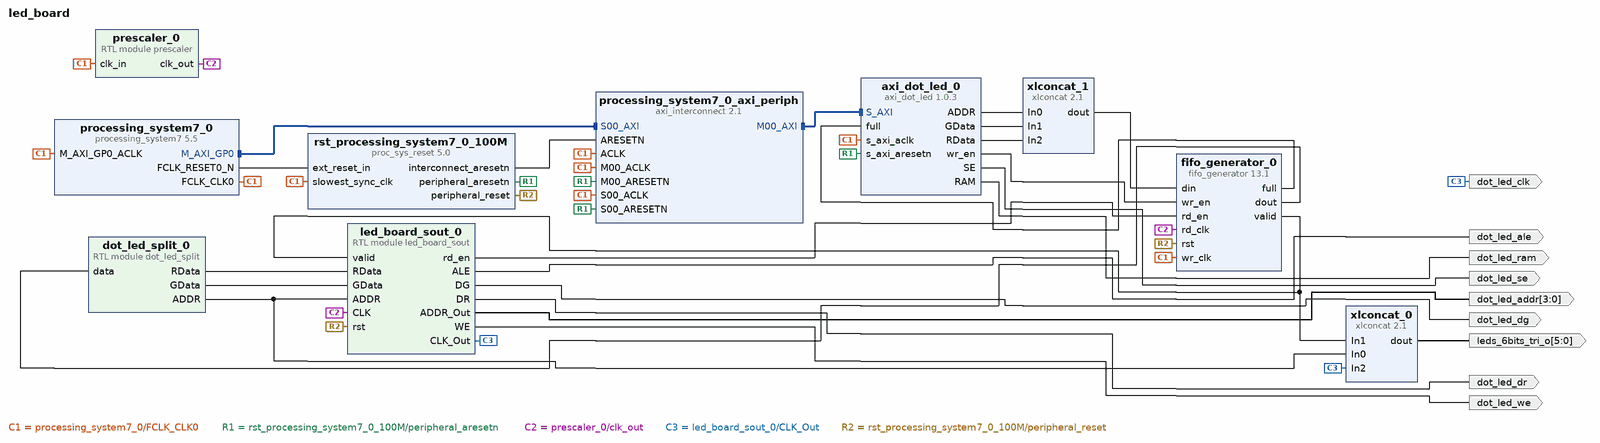
[diagram p0: block diagram of the top level]
# Vivado block design led_board, Vivado 2016.1
create_bd_design led_board

create_bd_port -dir O dot_led_se
create_bd_port -dir O dot_led_ram
create_bd_port -dir O dot_led_ale
create_bd_port -dir O dot_led_dr
create_bd_port -dir O dot_led_dg
create_bd_port -dir O dot_led_we
create_bd_port -dir O dot_led_clk
create_bd_port -dir O -from 5 -to 0 leds_6bits_tri_o
create_bd_port -dir O -from 3 -to 0 dot_led_addr

create_bd_cell -type ip -vlnv xilinx.com:ip:processing_system7:5.5 processing_system7_0
set_property -dict [list \
  CONFIG.PCW_FCLK_CLK0_BUF true \
  CONFIG.PCW_UIPARAM_DDR_FREQ_MHZ 525 \
  CONFIG.PCW_CRYSTAL_PERIPHERAL_FREQMHZ 50 \
  CONFIG.PCW_APU_PERIPHERAL_FREQMHZ 650 \
  CONFIG.PCW_SDIO_PERIPHERAL_FREQMHZ 50 \
  CONFIG.PCW_UART_PERIPHERAL_FREQMHZ 100 \
  CONFIG.PCW_FPGA0_PERIPHERAL_FREQMHZ 100 \
  CONFIG.PCW_FPGA1_PERIPHERAL_FREQMHZ 50 \
  CONFIG.PCW_M_AXI_GP0_FREQMHZ 10 \
  CONFIG.PCW_PERIPHERAL_BOARD_PRESET None \
  CONFIG.PCW_PRESET_BANK1_VOLTAGE {LVCMOS 1.8V} \
  CONFIG.PCW_UIPARAM_DDR_BUS_WIDTH {16 Bit} \
  CONFIG.PCW_UIPARAM_DDR_PARTNO {MT41J256M16 RE-125} \
  CONFIG.PCW_QSPI_PERIPHERAL_ENABLE 1 \
  CONFIG.PCW_QSPI_QSPI_IO {MIO 1 .. 6} \
  CONFIG.PCW_QSPI_GRP_SINGLE_SS_ENABLE 1 \
  CONFIG.PCW_QSPI_GRP_SINGLE_SS_IO {MIO 1 .. 6} \
  CONFIG.PCW_QSPI_GRP_FBCLK_ENABLE 1 \
  CONFIG.PCW_QSPI_GRP_FBCLK_IO {MIO 8} \
  CONFIG.PCW_ENET0_PERIPHERAL_ENABLE 1 \
  CONFIG.PCW_ENET0_ENET0_IO {MIO 16 .. 27} \
  CONFIG.PCW_ENET0_GRP_MDIO_ENABLE 1 \
  CONFIG.PCW_ENET0_GRP_MDIO_IO {MIO 52 .. 53} \
  CONFIG.PCW_ENET_RESET_ENABLE 1 \
  CONFIG.PCW_ENET_RESET_SELECT {Share reset pin} \
  CONFIG.PCW_ENET0_RESET_ENABLE 1 \
  CONFIG.PCW_ENET0_RESET_IO {MIO 9} \
  CONFIG.PCW_SD0_PERIPHERAL_ENABLE 1 \
  CONFIG.PCW_SD0_SD0_IO {MIO 40 .. 45} \
  CONFIG.PCW_SD0_GRP_CD_ENABLE 1 \
  CONFIG.PCW_SD0_GRP_CD_IO {MIO 47} \
  CONFIG.PCW_SD0_GRP_WP_ENABLE 0 \
  CONFIG.PCW_UART0_PERIPHERAL_ENABLE 1 \
  CONFIG.PCW_UART0_UART0_IO {MIO 14 .. 15} \
  CONFIG.PCW_UART1_PERIPHERAL_ENABLE 0 \
  CONFIG.PCW_USB0_PERIPHERAL_ENABLE 1 \
  CONFIG.PCW_USB0_USB0_IO {MIO 28 .. 39} \
  CONFIG.PCW_USB_RESET_ENABLE 1 \
  CONFIG.PCW_USB_RESET_SELECT {Share reset pin} \
  CONFIG.PCW_USB0_RESET_ENABLE 1 \
  CONFIG.PCW_USB0_RESET_IO {MIO 46} \
  CONFIG.PCW_I2C_RESET_ENABLE 1 \
  CONFIG.PCW_GPIO_MIO_GPIO_ENABLE 1 \
  CONFIG.PCW_GPIO_MIO_GPIO_IO MIO \
] [get_bd_cells processing_system7_0]
# 495 more settings of processing_system7_0 are not shown: defaults, MIO pin electricals, DDR timing, and values the tool derives
create_bd_cell -type ip -vlnv xilinx.com:ip:axi_interconnect:2.1 processing_system7_0_axi_periph
set_property -dict {CONFIG.NUM_MI 1} [get_bd_cells processing_system7_0_axi_periph]
create_bd_cell -type ip -vlnv xilinx.com:ip:proc_sys_reset:5.0 rst_processing_system7_0_100M
create_bd_cell -type ip -vlnv xilinx.com:ip:fifo_generator:13.1 fifo_generator_0
set_property -dict [list \
  CONFIG.Fifo_Implementation Independent_Clocks_Block_RAM \
  CONFIG.Performance_Options First_Word_Fall_Through \
  CONFIG.Input_Data_Width 68 \
  CONFIG.Input_Depth 32 \
  CONFIG.Output_Data_Width 68 \
  CONFIG.Full_Flags_Reset_Value 1 \
  CONFIG.Valid_Flag true \
  CONFIG.Overflow_Flag true \
] [get_bd_cells fifo_generator_0]
create_bd_cell -type ip -vlnv xilinx.com:ip:xlconcat:2.1 xlconcat_1
set_property -dict {CONFIG.NUM_PORTS 3 CONFIG.IN0_WIDTH 4 CONFIG.IN1_WIDTH 32 CONFIG.IN2_WIDTH 32} [get_bd_cells xlconcat_1]
create_bd_cell -type module -reference dot_led_split dot_led_split_0
create_bd_cell -type ip -vlnv xilinx.com:ip:xlconcat:2.1 xlconcat_0
set_property -dict {CONFIG.NUM_PORTS 3 CONFIG.IN0_WIDTH 4} [get_bd_cells xlconcat_0]
create_bd_cell -type ip -vlnv chibiegg.net:chibiegg:axi_dot_led:1.0.3 axi_dot_led_0
create_bd_cell -type module -reference led_board_sout led_board_sout_0
create_bd_cell -type module -reference prescaler prescaler_0

# ---- connections ----

connect_bd_intf_net [get_bd_intf_pins processing_system7_0/M_AXI_GP0] [get_bd_intf_pins processing_system7_0_axi_periph/S00_AXI]
connect_bd_intf_net [get_bd_intf_pins processing_system7_0_axi_periph/M00_AXI] [get_bd_intf_pins axi_dot_led_0/S_AXI]
connect_bd_net [get_bd_pins processing_system7_0/FCLK_CLK0] \
  [get_bd_pins processing_system7_0/M_AXI_GP0_ACLK] [get_bd_pins rst_processing_system7_0_100M/slowest_sync_clk] \
  [get_bd_pins fifo_generator_0/wr_clk] [get_bd_pins axi_dot_led_0/s_axi_aclk] \
  [get_bd_pins processing_system7_0_axi_periph/S00_ACLK] [get_bd_pins processing_system7_0_axi_periph/ACLK] \
  [get_bd_pins processing_system7_0_axi_periph/M00_ACLK] [get_bd_pins prescaler_0/clk_in]
connect_bd_net [get_bd_pins processing_system7_0/FCLK_RESET0_N] [get_bd_pins rst_processing_system7_0_100M/ext_reset_in]
connect_bd_net [get_bd_pins rst_processing_system7_0_100M/peripheral_aresetn] \
  [get_bd_pins axi_dot_led_0/s_axi_aresetn] [get_bd_pins processing_system7_0_axi_periph/S00_ARESETN] \
  [get_bd_pins processing_system7_0_axi_periph/M00_ARESETN]
connect_bd_net [get_bd_pins rst_processing_system7_0_100M/interconnect_aresetn] [get_bd_pins processing_system7_0_axi_periph/ARESETN]
connect_bd_net [get_bd_pins xlconcat_1/dout] [get_bd_pins fifo_generator_0/din]
connect_bd_net [get_bd_pins fifo_generator_0/full] [get_bd_pins axi_dot_led_0/full]
connect_bd_net [get_bd_pins axi_dot_led_0/ADDR] [get_bd_pins xlconcat_1/In0]
connect_bd_net [get_bd_pins axi_dot_led_0/GData] [get_bd_pins xlconcat_1/In1]
connect_bd_net [get_bd_pins axi_dot_led_0/RData] [get_bd_pins xlconcat_1/In2]
connect_bd_net [get_bd_pins prescaler_0/clk_out] [get_bd_pins fifo_generator_0/rd_clk] [get_bd_pins led_board_sout_0/CLK]
connect_bd_net [get_bd_pins dot_led_split_0/RData] [get_bd_pins led_board_sout_0/RData]
connect_bd_net [get_bd_pins dot_led_split_0/GData] [get_bd_pins led_board_sout_0/GData]
connect_bd_net [get_bd_pins fifo_generator_0/dout] [get_bd_pins dot_led_split_0/data]
connect_bd_net [get_bd_pins axi_dot_led_0/SE] [get_bd_ports dot_led_se]
connect_bd_net [get_bd_pins axi_dot_led_0/RAM] [get_bd_ports dot_led_ram]
connect_bd_net [get_bd_pins led_board_sout_0/ALE] [get_bd_ports dot_led_ale]
connect_bd_net [get_bd_pins led_board_sout_0/DR] [get_bd_ports dot_led_dr]
connect_bd_net [get_bd_pins led_board_sout_0/DG] [get_bd_ports dot_led_dg]
connect_bd_net [get_bd_pins led_board_sout_0/WE] [get_bd_ports dot_led_we]
connect_bd_net [get_bd_pins led_board_sout_0/rd_en] [get_bd_pins fifo_generator_0/rd_en]
connect_bd_net [get_bd_pins led_board_sout_0/CLK_Out] [get_bd_ports dot_led_clk] [get_bd_pins xlconcat_0/In2]
connect_bd_net [get_bd_pins xlconcat_0/dout] [get_bd_ports leds_6bits_tri_o]
connect_bd_net [get_bd_pins axi_dot_led_0/wr_en] [get_bd_pins fifo_generator_0/wr_en]
connect_bd_net [get_bd_pins fifo_generator_0/valid] [get_bd_pins xlconcat_0/In1] [get_bd_pins led_board_sout_0/valid]
connect_bd_net [get_bd_pins rst_processing_system7_0_100M/peripheral_reset] [get_bd_pins fifo_generator_0/rst] [get_bd_pins led_board_sout_0/rst]
connect_bd_net [get_bd_pins dot_led_split_0/ADDR] [get_bd_pins led_board_sout_0/ADDR] [get_bd_pins xlconcat_0/In0]
connect_bd_net [get_bd_pins led_board_sout_0/ADDR_Out] [get_bd_ports dot_led_addr]

# ---- address map ----
assign_bd_address -offset 0x43C00000 -range 4K -target_address_space [get_bd_addr_spaces processing_system7_0/Data] [get_bd_addr_segs axi_dot_led_0/S_AXI/S_AXI_reg]

validate_bd_design
save_bd_design
